# EAGLE design signal_gang (EAGLE 9.6.2)
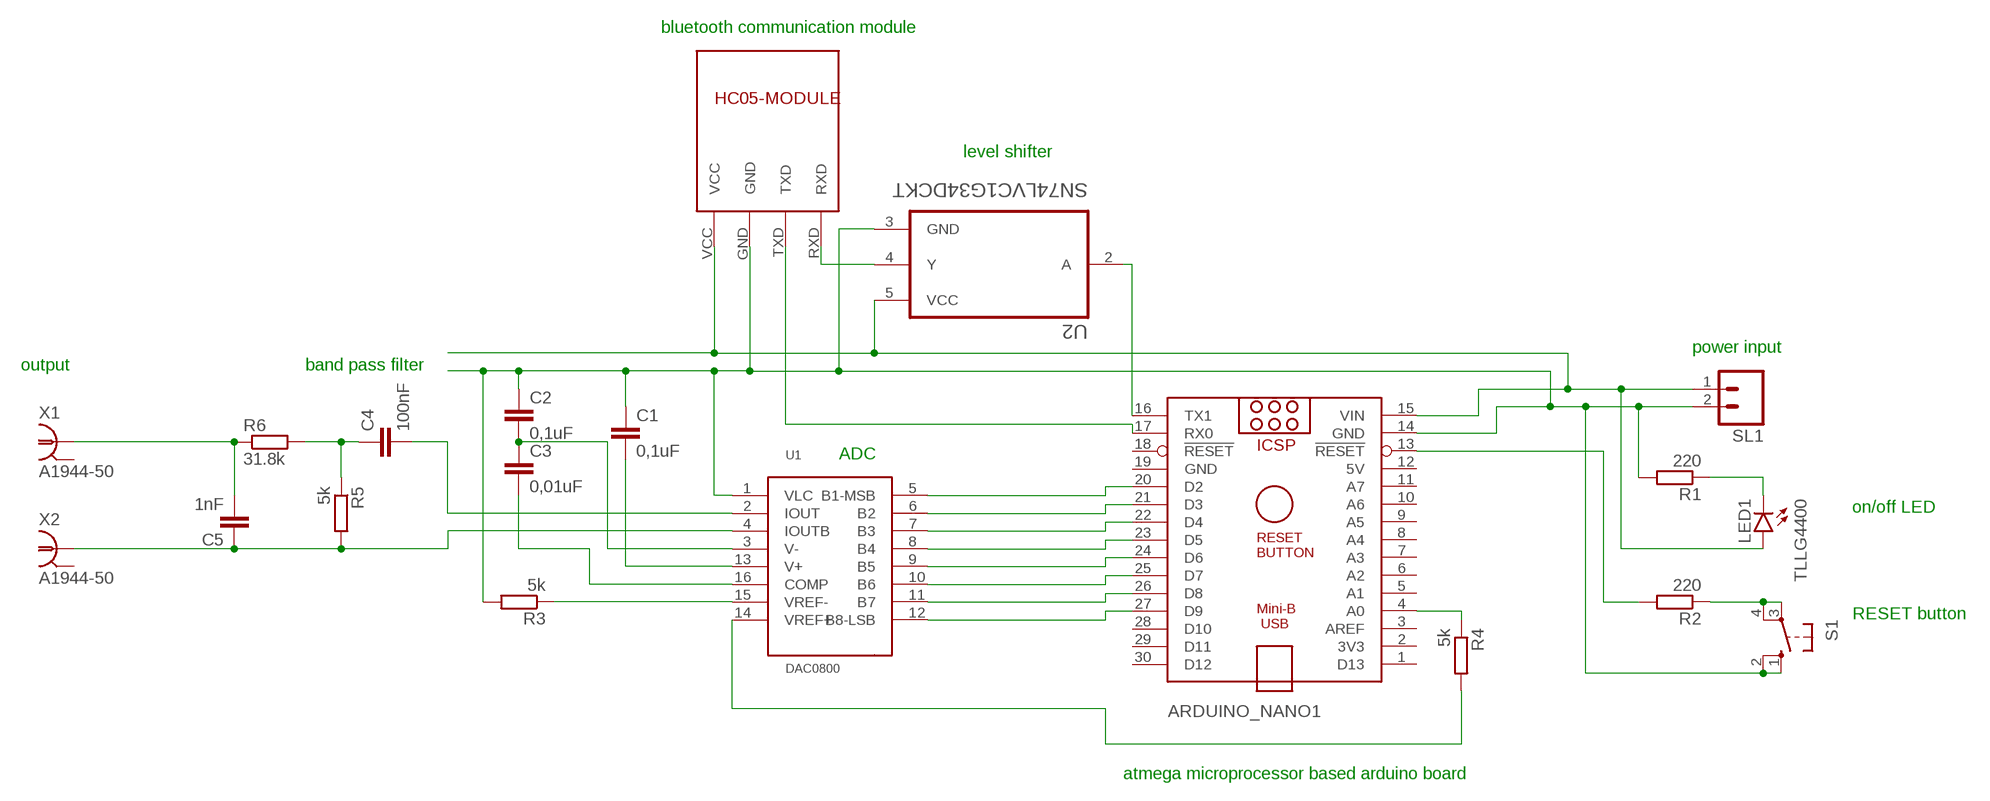
[diagram p0: schematic, sheet 1]

## Parts
ARDUINO_NANO1  ARDUINO_NANO  [ARDUINO_NANO]
C1  0,1uF  C2.5/2  [C2.5-2]
C2  0,1uF  C2.5/2  [C2.5-2]
C3  0,01uF  C2.5/2  [C2.5-2]
C4  100nF  C2.5/2  [C2.5-2]
C5  1nF  C2.5/2  [C2.5-2]
LED1  TLLG4400  [LED3MM]
R1  220  R-EU_0207/10  [0207/10]
R2  220  R-EU_0207/10  [0207/10]
R3  5k  R-EU_0207/10  [0207/10]
R4  5k  R-EU_0207/10  [0207/10]
R5  5k  R-EU_0207/10  [0207/10]
R6  31.8k  R-EU_0207/10  [0207/10]
S1  10-XX  [B3F-10XX]
SL1  M02  [02P]
U1  DAC0800  [DIL16]
U2  SN74LVC1G34DCKT  [SOT65P210X110-5N]
U$1  HC05-MODULE  [HC05_MODULE]
X1  A1944-50  [A1944]
X2  A1944-50  [A1944]

## Nets
N$1: ARDUINO_NANO1.20(D2) U1.5(B1-MSB)
N$2: ARDUINO_NANO1.16(TX1) U2.2(A)
N$3: ARDUINO_NANO1.4(A0) R4.1
N$4: ARDUINO_NANO1.21(D3) U1.6(B2)
N$5: ARDUINO_NANO1.22(D4) U1.7(B3)
N$6: ARDUINO_NANO1.23(D5) U1.8(B4)
N$7: ARDUINO_NANO1.24(D6) U1.9(B5)
N$8: ARDUINO_NANO1.25(D7) U1.10(B6)
N$9: ARDUINO_NANO1.26(D8) U1.11(B7)
N$10: ARDUINO_NANO1.27(D9) U1.12(B8-LSB)
N$11: C5.1 R5.2 U1.4(IOUTB) X2.1
N$12: ARDUINO_NANO1.17(RX0) U$1.TXD
N$13: ARDUINO_NANO1.15(VIN) LED1.A SL1.1 U2.5(VCC) U$1.VCC
N$14: U2.4(Y) U$1.RXD
N$15: LED1.K(C) R1.1
N$16: C4.1 R5.1 R6.2
N$17: ARDUINO_NANO1.13(!RESET) R2.2
N$18: R2.1 S1.3(P) S1.4(P1)
N$19: ARDUINO_NANO1.14(GND) C1.1 C2.1 R1.2 R3.2 S1.1(S) S1.2(S1) SL1.2 U1.1(VLC) U2.3(GND) U$1.GND
N$20: R3.1 U1.15(VREF-)
N$21: C1.2 U1.13(V+)
N$22: C3.2 U1.16(COMP)
N$23: C2.2 C3.1 U1.3(V-)
N$24: C4.2 U1.2(IOUT)
N$25: R4.2 U1.14(VREF+)
N$26: C5.2 R6.1 X1.1
Unconnected: ARDUINO_NANO1.1(D13) ARDUINO_NANO1.2(3V3) ARDUINO_NANO1.3(AREF) ARDUINO_NANO1.5(A1) ARDUINO_NANO1.6(A2) ARDUINO_NANO1.7(A3) ARDUINO_NANO1.8(A4) ARDUINO_NANO1.9(A5) ARDUINO_NANO1.10(A6) ARDUINO_NANO1.11(A7) ARDUINO_NANO1.18(!RESET) ARDUINO_NANO1.28(D10) ARDUINO_NANO1.29(D11) ARDUINO_NANO1.30(D12) X1.2 X1.3 X1.4 X1.5 X2.2 X2.3 X2.4 X2.5

## Notes on the sheet
- bluetooth communication module
- level shifter
- power input
- output | band pass filter
- ADC
- on/off LED
- RESET button
- atmega microprocessor based arduino board

## Power pins joined to a net without a drawn wire
5V: ARDUINO_NANO1.12(5V)
GND: ARDUINO_NANO1.19(GND)

## Library data of the parts
ARDUINO_NANO1 = ArduinoNanoV30:ARDUINO_NANO: Arduino Nano V3.0 Overview: The Arduino Nano is a small, complete, and breadboard-friendly board based on the ATmega328 (Arduino Nano 3.x) or ATmega168 (Arduino Nano 2.x). It has more or less the same functionality of the Arduino Duemilanove, but in a different package. It lacks only a DC power jack, and works with a Mini-B USB cable instead of a standard one. The Nano was designed and is being produced by Gravitech. Specifications: Microcontroller Atmel ATmega168 or ATmega328 Operating Voltage (logic level) 5 V Input Voltage (recommended) 7-12 V Input Voltage (limits) 6-20 V Digital I/O Pins 14 (of which 6 provide PWM output) Analog Input Pins 8 DC Current per I/O Pin 40 mA Flash Memory 16 KB (ATmega168) or 32 KB (ATmega328) of which 2 KB used by bootloader SRAM 1 KB (ATmega168) or 2 KB (ATmega328) EEPROM 512 bytes (ATmega168) or 1 KB (ATmega328) Clock Speed 16 MHz Dimensions 0.73" x 1.70" Length 45 mm Width 18 mm Weigth 5 g Power: The Arduino Nano can be powered via the Mini-B USB connection, 6-20V unregulated external power supply (pin 30), or 5V regulated external power supply (pin 27). The power source is automatically selected to the highest voltage source. Memory: The ATmega168 has 16 KB of flash memory for storing code (of which 2 KB is used for the bootloader); the ATmega328 has 32 KB, (also with 2 KB used for the bootloader). The ATmega168 has 1 KB of SRAM and 512 bytes of EEPROM (which can be read and written with the EEPROM library); the ATmega328 has 2 KB of SRAM and 1 KB of EEPROM. Input and Output: Each of the 14 digital pins on the Nano can be used as an input or output, using pinMode(), digitalWrite(), and digitalRead() functions. They operate at 5 volts. Each pin can provide or receive a maximum of 40 mA and has an internal pull-up resistor (disconnected by default) of 20-50 kOhms. In addition, some pins have specialized functions. Visit Arduino - ArduinoBoardNano <https://www.arduino.cc/en/Main/ArduinoBoardNano>
C1-C5 = capacitor-wima:C: CAPACITOR naming: grid - package width
LED1 = led:TLLG4400: Low Current (2mA) LED 3 mm Tinted Diffused Package color GREEN Source: Data sheet <http://www.farnell.com/datasheets/391098.pdf>; MF: VISHAY SEMICONDUCTOR; OC_FARNELL: 1612435
R1-R6 = rcl:R-EU_: RESISTOR, European symbol; SPICEPREFIX: R
S1 = switch-omron:10-XX: OMRON SWITCH; MPN: B3F-1000; OC_FARNELL: 176432; OC_NEWARK: 36M3542
SL1 = con-amp-quick:M02: AMP QUICK CONNECTOR; OC_FARNELL: unknown; OC_NEWARK: unknown
U1 = DAC0800:DAC0800: 8 Bit Parallel DAC Check availability <https://pricing.snapeda.com/parts/DAC0800/Texas%20Instruments/view-part?ref=eda>; AVAILABILITY: In Stock; DESCRIPTION: 8 Bit Digital to Analog Converter 1 16-SOIC; MF: Texas Instruments; MP: DAC0800; PACKAGE: SOIC-16 Texas Instruments; PRICE: None; PURCHASE-URL: https://pricing.snapeda.com/search/part/DAC0800/?ref=eda
U2 = SN74LVC1G34DCKT:SN74LVC1G34DCKT: Check availability <https://pricing.snapeda.com/parts/SN74LVC1G34DCKT/Texas%20Instruments/view-part?ref=eda>; AVAILABILITY: In Stock; DESCRIPTION: Single 1.65-V to 5.5-V buffer; MF: Texas Instruments; MP: SN74LVC1G34DCKT; PACKAGE: SOT-SC70-5 Texas Instruments; PRICE: None; PURCHASE-URL: https://pricing.snapeda.com/search/part/SN74LVC1G34DCKT/?ref=eda
U$1 = signal_gang_lib:HC05-MODULE
X1 X2 = con-coax:A1944-50: BNC CONNECTOR 50 Ohm distributor Buerklin 78F2475; OC_FARNELL: unknown; OC_NEWARK: unknown

## Board
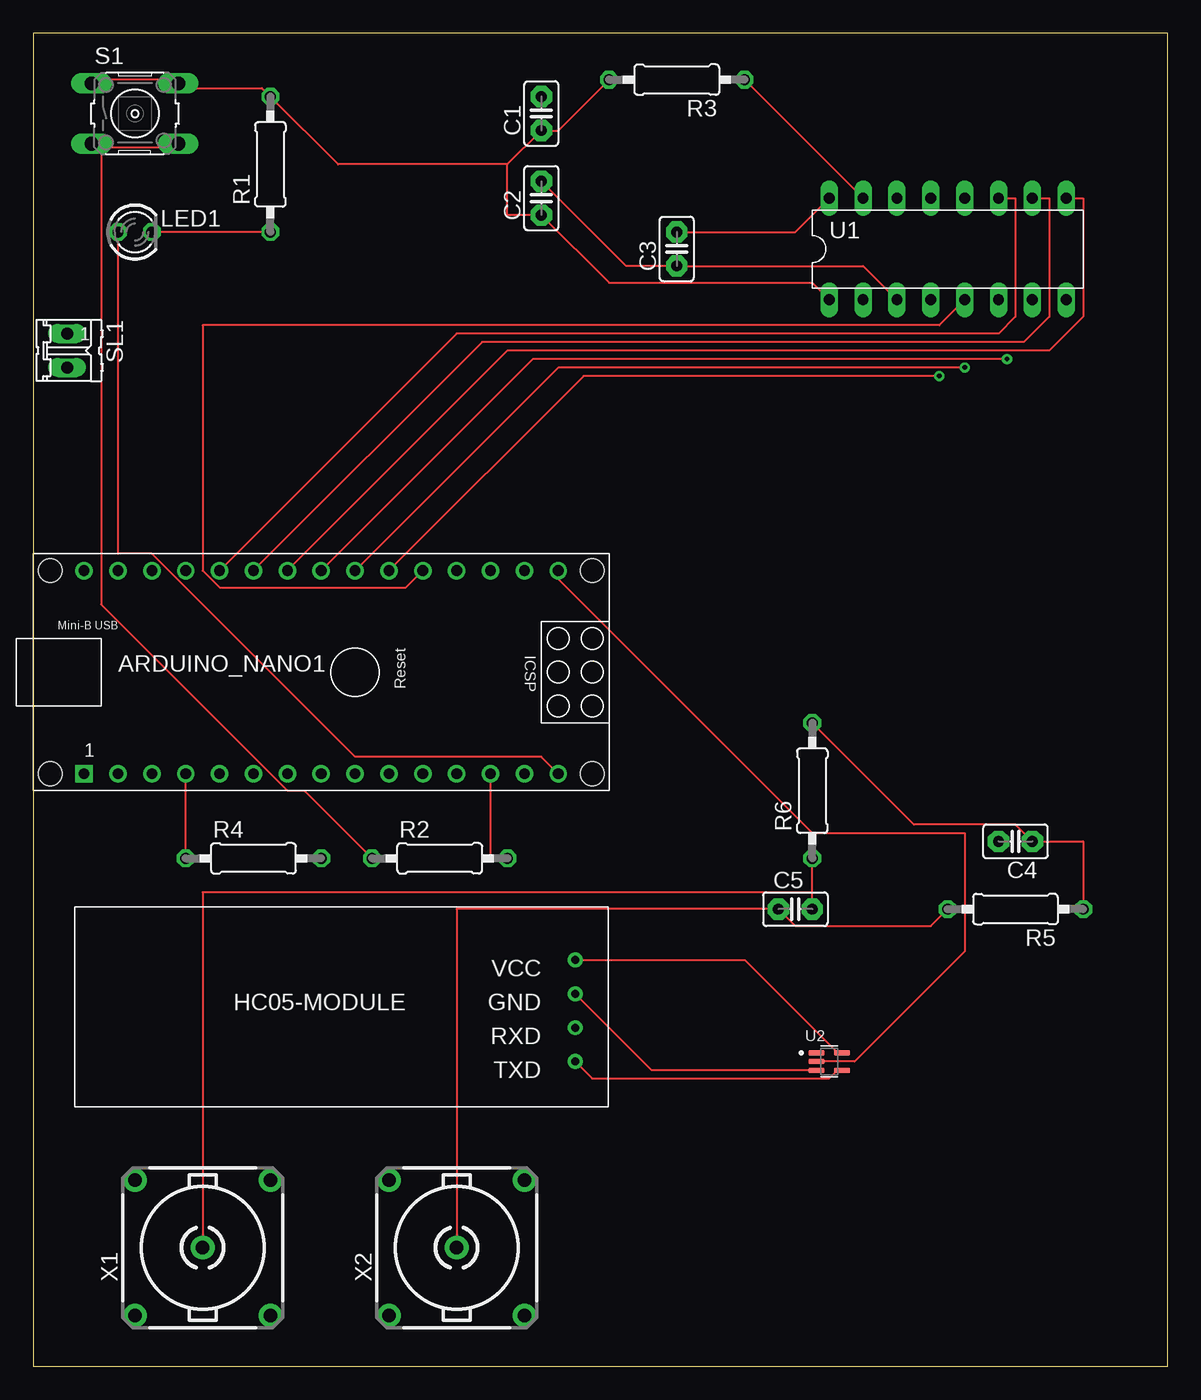
[diagram p1: board, top side]
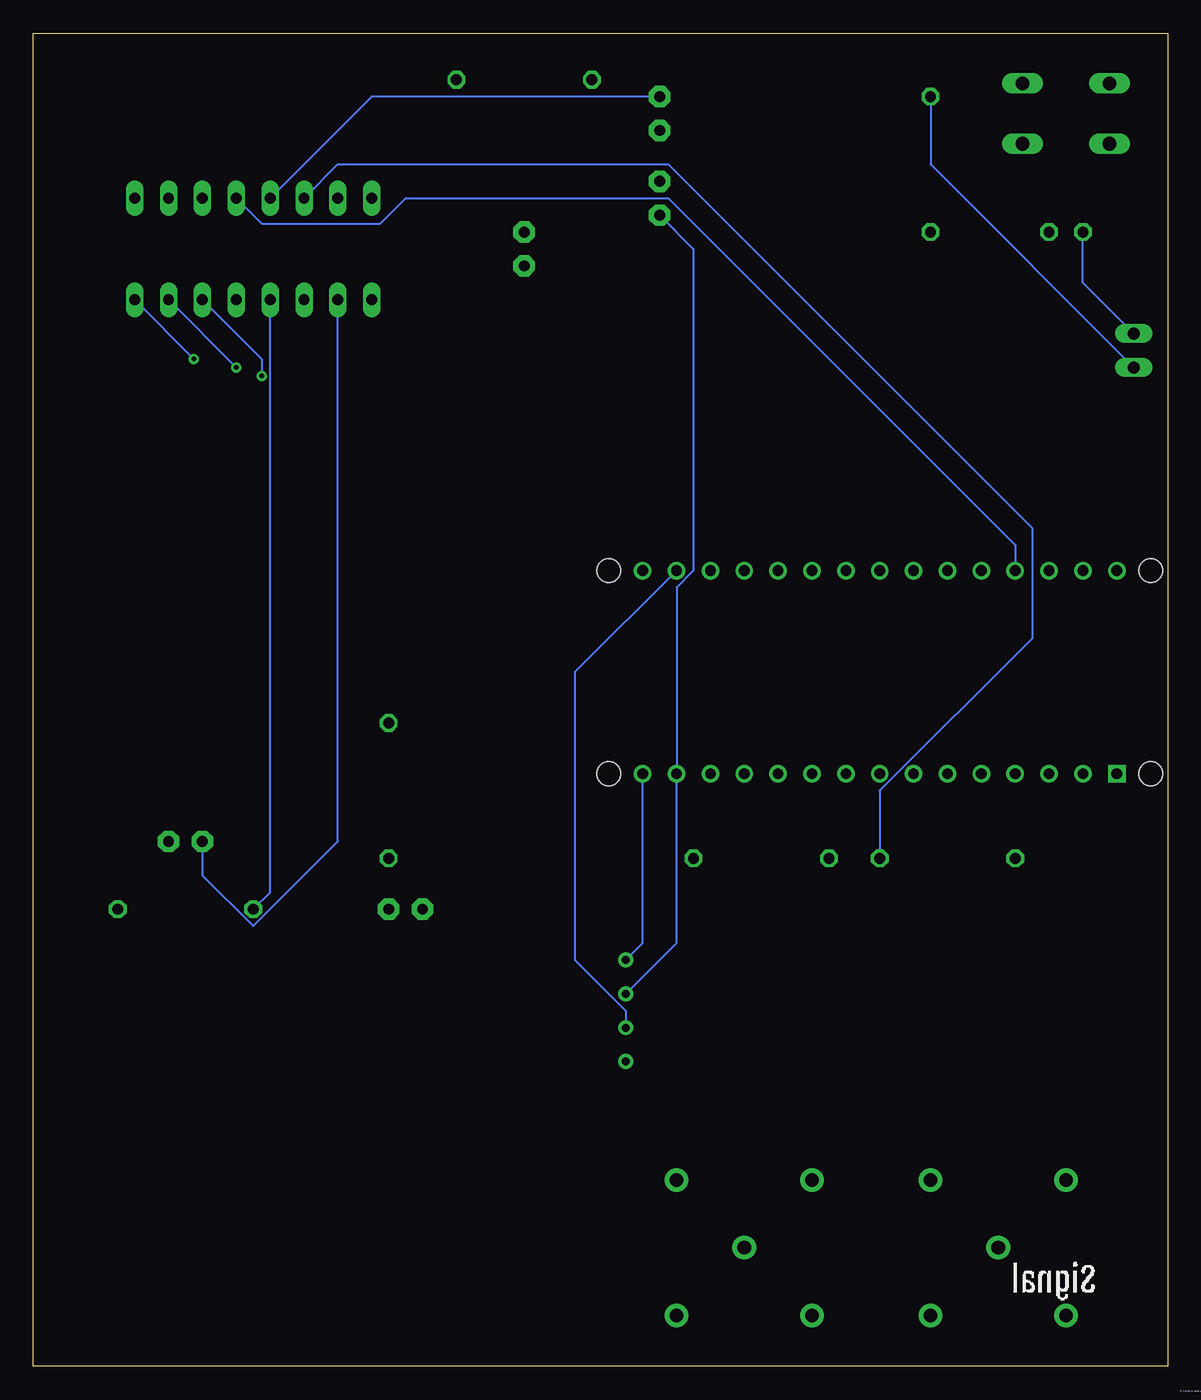
[diagram p2: board, bottom side, seen from below]

Size 85.07 x 100 mm. Coordinates in mm from the lower left corner, seen from the top.
Outline: 0,0 85.07,0 85.07,100 0,100 0,0
Copper layers (1*16): Top 0.035mm / dielectric 1.5mm / Bottom 0.035mm
Design rules "default": minimum track width 6mil, minimum drill 0.35mm, track to track 6mil, track to pad 6mil, pad to pad 6mil, via to via 6mil, smd to smd 6mil, copper to edge 40mil, drill to drill 6mil, minimum pad ring 10mil, minimum via ring 8mil, stop-mask expansion 4mil, vias tented up to drill 0mil, thermal gap 10mil

### Footprints (pad centres in the part's own frame; a part is rotated, then mirrored left to right if it is on the bottom)
ARDUINO_NANO = drill 0.8 square: 1 -20.32,-7.62 | drill 0.8: 2 -17.78,-7.62; 3 -15.24,-7.62; 4 -12.7,-7.62; 5 -10.16,-7.62; 6 -7.62,-7.62; 7 -5.08,-7.62; 8 -2.54,-7.62; 9 0,-7.62; 10 2.54,-7.62; 11 5.08,-7.62; 12 7.62,-7.62; 13 10.16,-7.62; 14 12.7,-7.62; 15 15.24,-7.62; 16 15.24,7.62; 17 12.7,7.62; 18 10.16,7.62; 19 7.62,7.62; 20 5.08,7.62; 21 2.54,7.62; 22 0,7.62; 23 -2.54,7.62; 24 -5.08,7.62; 25 -7.62,7.62; 26 -10.16,7.62; 27 -12.7,7.62; 28 -15.24,7.62; 29 -17.78,7.62; 30 -20.32,7.62 | hole 1.778: -22.86,-7.62; -22.86,7.62; 17.78,7.62; 17.78,-7.62
C2.5-2 = drill 0.813 pad 1.6 octagon: 1 -1.27,0; 2 1.27,0
LED3MM = drill 0.813 octagon: A -1.27,0; K 1.27,0
0207/10 = drill 0.813 octagon: 1 -5.08,0; 2 5.08,0
B3F-10XX = drill 1.016 long: 1 -3.251,2.261; 2 3.251,2.261; 3 -3.251,-2.261; 4 3.251,-2.261
02P = drill 0.914 long: 1 -1.27,0; 2 1.27,0
DIL16 = drill 0.813 long: 1 -8.89,-3.81; 2 -6.35,-3.81; 3 -3.81,-3.81; 4 -1.27,-3.81; 5 1.27,-3.81; 6 3.81,-3.81; 7 6.35,-3.81; 8 8.89,-3.81; 9 8.89,3.81; 10 6.35,3.81; 11 3.81,3.81; 12 1.27,3.81; 13 -1.27,3.81; 14 -3.81,3.81; 15 -6.35,3.81; 16 -8.89,3.81
SOT65P210X110-5N = smd 1.19 x 0.4: 1 -0.96,0.65; 2 -0.96,0; 3 -0.96,-0.65; 4 0.96,-0.65; 5 0.96,0.65
HC05_MODULE = drill 0.6: GND -16.51,-2.54; RXD -21.59,-2.54; TXD -19.05,-2.54; VCC -13.97,-2.54
A1944 = drill 1.016 pad 1.778: 1 0,0; 2 5.08,5.08; 3 -5.08,5.08; 4 -5.08,-5.08; 5 5.08,-5.08

### Placement (x,y rotation side)
ARDUINO_NANO1  24.13,52.07 0 top
C1  38.1,93.98 90 top
C2  38.1,87.63 90 top
C3  48.26,83.82 90 top
C4  73.66,39.37 180 top
C5  57.15,34.29 0 top
LED1  7.62,85.09 0 top
R1  17.78,90.17 90 top
R2  30.48,38.1 0 top
R3  48.26,96.52 180 top
R4  16.51,38.1 0 top
R5  73.66,34.29 180 top
R6  58.42,43.18 90 top
S1  7.62,93.98 0 top
SL1  2.54,76.2 270 top
U1  68.58,83.82 0 top
U2  59.69,22.86 0 top
U$1  38.1,44.45 90 top
X1  12.7,8.89 90 top
X2  31.75,8.89 90 top

### Tracks (layer width: path | path; a pad name or v marks a point on that pad's centre or on a via)
N$1
  Top 0.152: ARDUINO_NANO1.20 27.94,58.42 13.97,58.42 12.7,59.69 12.7,78.11 67.94,78.11 U1.5
N$2
  Top 0.152: U2.2 61.59,22.86 69.85,31.11 69.85,40.01 58.42,40.01 39.37,59.05 ARDUINO_NANO1.16
N$3
  Top 0.152: R4.1 ARDUINO_NANO1.4
N$4  (via drill 0.35)
  Top 0.152: ARDUINO_NANO1.21 41.27,74.3 v67.94,74.3
  Bottom 0.152: v67.94,74.3 67.94,75.56 U1.6
N$5  (via drill 0.35)
  Top 0.152: ARDUINO_NANO1.22 39.37,74.93 v69.85,74.93
  Bottom 0.152: U1.7 v69.85,74.93
N$6  (via drill 0.35)
  Top 0.152: ARDUINO_NANO1.23 37.47,75.56 v73.03,75.56
  Bottom 0.152: U1.8 v73.03,75.56
N$7
  Top 0.152: ARDUINO_NANO1.24 35.56,76.2 76.2,76.2 78.74,78.74 78.74,87.63 U1.9
N$8
  Top 0.152: ARDUINO_NANO1.25 33.66,76.83 74.3,76.83 76.2,78.74 76.2,87.63 U1.10
N$9
  Top 0.152: ARDUINO_NANO1.26 31.75,77.47 72.39,77.47 73.66,78.74 73.66,87.63 U1.11
N$10
  Bottom 0.152: ARDUINO_NANO1.27 11.43,61.59 37.47,87.63 57.15,87.63 59.05,85.72 67.94,85.72 U1.12
N$11
  Top 0.152: R5.2 67.31,33.02 57.15,33.02 C5.1 31.75,34.29 X2.1
  Bottom 0.152: U1.4 67.31,35.56 R5.2
N$12
  Bottom 0.152: U$1.TXD 40.64,26.67 44.45,30.48 44.45,52.07 ARDUINO_NANO1.17
N$13
  Top 0.152: U$1.VCC 53.34,30.48 60.33,23.5 U2.5 | LED1.A 6.35,60.96 8.89,60.96 24.13,45.72 38.1,45.72 ARDUINO_NANO1.15
  Bottom 0.152: LED1.A 6.35,81.28 SL1.1 | ARDUINO_NANO1.15 39.37,31.75 U$1.VCC
N$14
  Top 0.152: U$1.RXD 41.91,21.59 59.69,21.59 60.33,22.23 U2.4
N$15
  Top 0.152: R1.1 LED1.K
N$16
  Top 0.152: R6.2 66.04,40.64 73.66,40.64 C4.1 78.74,39.37 R5.1
N$17
  Top 0.152: ARDUINO_NANO1.13 34.29,38.1 R2.2
N$18
  Top 0.152: R2.1 20.32,43.18 19.05,43.18 5.08,57.15 5.08,91.44 | 5.08,91.44 4.45,91.44 S1.3 5.08,91.44 | 5.08,91.44 10.79,91.44 S1.4
N$19
  Top 0.152: U$1.GND 46.35,22.23 58.42,22.23 U2.3 | S1.1 4.45,96.52 10.79,96.52 S1.2 11.43,95.89 17.14,95.89 R1.2 22.86,90.17 35.56,90.17 | R3.2 39.37,92.71 C1.1 35.56,90.17 | U1.1 58.42,81.28 43.18,81.28 C2.1 35.56,86.36 35.56,90.17
  Bottom 0.152: U$1.GND 36.83,31.75 ARDUINO_NANO1.14 36.83,58.42 35.56,59.69 35.56,83.82 C2.1 | SL1.2 17.78,90.17 R1.2
N$20
  Top 0.152: R3.1 U1.15
N$21
  Bottom 0.152: U1.13 59.69,95.25 C1.2
N$22
  Top 0.152: U1.16 57.15,85.09 C3.2
N$23
  Top 0.152: U1.3 62.23,82.55 C3.1 44.45,82.55 C2.2
N$24
  Bottom 0.152: U1.2 62.23,39.37 68.58,33.02 72.39,36.83 C4.2
N$25
  Bottom 0.152: R4.2 21.59,43.18 10.16,54.61 10.16,62.87 37.47,90.17 62.23,90.17 U1.14
N$26
  Top 0.152: C5.2 58.42,35.56 | 58.42,35.56 R6.1 | X1.1 12.7,35.56 58.42,35.56
(copper drawn outside any net)
  shapes: Top area x2

### Text on the board
bPlace: C:/Users/ataka/OneDrive/Masaüstü/logo_team.bmp